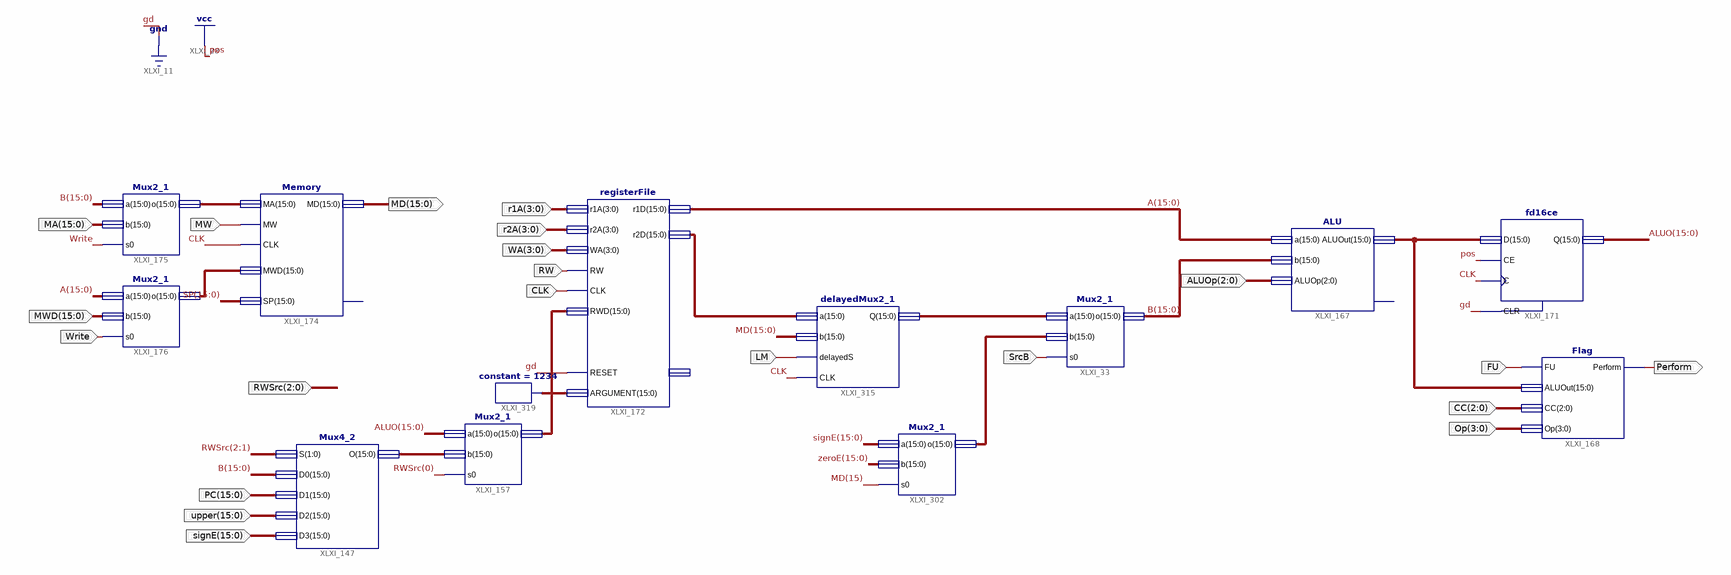
[diagram p0: schematic sheet 1]
// Xilinx ISE schematic IntegratedTestMemRFALUFlag.sch (spartan3e) as structural Verilog: 13 symbols, 21 ports
module IntegratedTestMemRFALUFlag (
  input  CLK,
  input  MW,
  input  [2:0] ALUOp,
  input  SrcB,
  input  FU,
  input  [3:0] Op,
  input  [2:0] CC,
  input  RW,
  input  [15:0] PC,
  input  [15:0] upper,
  input  [15:0] signE,
  input  [2:0] RWSrc,
  input  [3:0] r1A,
  input  [3:0] r2A,
  input  [3:0] WA,
  input  [15:0] MWD,
  input  Write,
  input  [15:0] MA,
  input  LM,
  output [15:0] MD,
  output Perform
);

  wire [15:0] A, ALUO, B, SP, XLXN_94, XLXN_111, XLXN_605, XLXN_637, XLXN_642, XLXN_648, XLXN_653, XLXN_949,
       yvhubyu, zeroE;

  ALU XLXI_167 (.a(A), .b(B), .ALUOp(ALUOp), .ALUOut(XLXN_637));  // open: Overflow
  Flag XLXI_168 (.FU(FU), .ALUOut(XLXN_637), .CC(CC), .Op(Op), .Perform(Perform));
  fd16ce XLXI_171 (.C(CLK), .CE(1'b1), .CLR(1'b0), .D(XLXN_637), .Q(ALUO));
  registerFile XLXI_172 (
    .RW(RW), .CLK(CLK), .r1A(r1A), .r2A(r2A), .WA(WA),
    .RWD({XLXN_642[0], XLXN_642[1], XLXN_642[2], XLXN_642[3], XLXN_642[4], XLXN_642[5], XLXN_642[6], XLXN_642[7], XLXN_642[8], XLXN_642[9], XLXN_642[10], XLXN_642[11], XLXN_642[12], XLXN_642[13], XLXN_642[14], XLXN_642[15]}),
    .ARGUMENT(XLXN_653), .r1D(A), .r2D(XLXN_111), .RESET(1'b0));  // open: DISPLAY
  Mux2_1 XLXI_157 (
    .a(ALUO), .b(XLXN_605), .s0(RWSrc[0]),
    .o({XLXN_642[0], XLXN_642[1], XLXN_642[2], XLXN_642[3], XLXN_642[4], XLXN_642[5], XLXN_642[6], XLXN_642[7], XLXN_642[8], XLXN_642[9], XLXN_642[10], XLXN_642[11], XLXN_642[12], XLXN_642[13], XLXN_642[14], XLXN_642[15]}));
  Mux4_2 XLXI_147 (.S(RWSrc[2:1]), .D0(B), .D3(signE), .O(XLXN_605), .D1(PC), .D2(upper));
  Mux2_1 XLXI_175 (.a(B), .b(MA), .s0(Write), .o(yvhubyu));
  Mux2_1 XLXI_176 (.a(A), .b(MWD), .s0(Write), .o(XLXN_648));
  Memory XLXI_174 (.MA(yvhubyu), .MW(MW), .MD(MD), .CLK(CLK), .MWD(XLXN_648), .SP(SP));  // open: segFault
  constant #(.CValue("1234")) XLXI_319 (.O(XLXN_653));
  delayedMux2_1 XLXI_315 (.Q(XLXN_94), .delayedS(LM), .CLK(CLK), .a(XLXN_111), .b(MD));
  Mux2_1 XLXI_302 (.a(signE), .b(zeroE), .s0(MD[15]), .o(XLXN_949));
  Mux2_1 XLXI_33 (.a(XLXN_94), .b(XLXN_949), .s0(SrcB), .o(B));
endmodule
